# Altium schematic sheet Buck.SchDoc
size A4
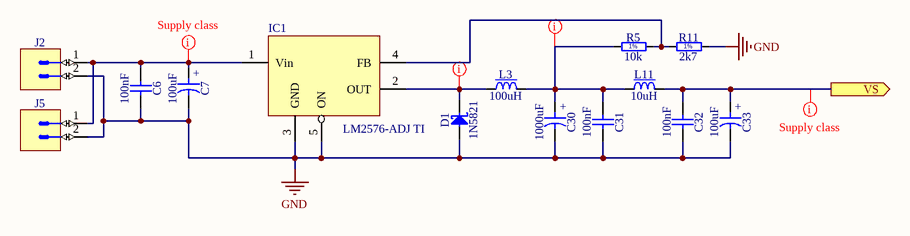
[diagram p0: Buck.SchDoc]

## Parts
C6  100nF  [CAPC2012X135N]
C7  100uF  [CAPAE660X540N]
C30  1000uF  [CAPPR750-1650X1600]
C31  100nF  [CAPC2012X135N]
C32  100nF  [CAPC2012X135N]
C33  100uF  [CAPAE660X540N]
D1  1N5821  [DO-201AD]
IC1  LM2576-ADJ TI  [DPAK170P1435X465-6N]
J2  (no value)  [CAMDEN_CTB9350/2A]
J5  KK®  [MOLEX_22-04-1021]  (value not drawn)
L3  100uH  [IND_WURTH_WE-PD_XXL]
L11  10uH  [INDM6965X300N]
R5  10k  [RESC2012X60N]
R11  2k7  [RESC2012X60N]

## Ports
VS (out)

## Nets
GND: C6.2 C7.2 C30.2 C31.2 C32.2 C33.2 D1.2(A) IC1.3(GND) IC1.5(ON) J2.2 J5.2 R11.2
VS: C32.1 C33.1 L11.2 ; port VS
NetC6_1: C6.1 C7.1 IC1.1(Vin) J2.1 J5.1
NetC30_1: C30.1 C31.1 L3.2 L11.1 R5.1
NetD1_1: D1.1(C) IC1.2(OUT) L3.1
NetIC1_4: IC1.4(FB) R5.2 R11.1

Not connected (* = marked no-connect by the designer): IC1 6(GND)

## Layout directives
net class Supply: NetC6_1, NetC30_1, NetD1_1, VS

## Notes on the sheet
- (in symbol CAE660-540_100UF_16V_20%) +
- (in symbol CAER_1000UF_25V_20%_PANASONIC_EEUFC1E102S) +
- (in symbol R0805_2K7_1%_0.125W_100PPM) 1%
- (in symbol R0805_10K_1%_0.125W_100PPM) 1%

## Library data of the parts
C6 C31 C32 = CC0805_100NF_50V_10%_X7R: Non-polarised capacitor; Part Description: SMD Multilayer Chip Ceramic Capacitor; Manufacturer: GENERIC; Manufacturer1 Part Number: C2012X7R1H104K085AA; Voltage: 50V; TC: X7R; Tolerance: ±10%; Part Number: CC0805_100NF_50V_10%_X7R; Component Kind: Standard; Component Type: Standard; Pin Count: 2; Value: 100nF; Status: Preferred; Manufacturer Part Number: CC0805_100NF_50V_10%_X7R; Case: 0805; Mounted: Yes; Socket: No; SMD: Yes; Sense: No; Manufacturer1 Example: TDK; Manufacturer1 ComponentHeight: 1mm; HelpURL: \\cern.ch\dfs\Applications\Altium\Datasheets\CC0805_X7R_TDK_C.pdf; Author: CERN DEM JLC; CreateDate: 03.12.2007; LatestRevisionDate: 22.04.2015
C7 C33 = CAE660-540_100UF_16V_20%: Polarised capacitor; Part Description: Aluminum Electrolytic SMT Capacitor; Manufacturer: PANASONIC; Manufacturer Part Number: EEEFK1C101AP; Voltage: 16V; Tolerance: ±20%; Part Number: CAE660-540_100UF_16V_20%; Component Kind: Standard; Component Type: Standard; Pin Count: 2; Value: 100uF; Status: Not Recommended; Case: D; Mounted: Yes; Socket: No; SMD: Yes; Sense: No; ComponentHeight: 5.8mm; HelpURL: \\cern.ch\dfs\Applications\Altium\Datasheets\CAE_PANASONIC_FK.pdf; Author: CERN DEM JLC; CreateDate: 03.12.2007; LatestRevisionDate: 05.11.2014
C30 = CAER_1000UF_25V_20%_PANASONIC_EEUFC1E102S: Polarised capacitor; Part Description: Z= 0R043, Radial Lead, Aluminum Electrolytic Capacitor, (FC Series, Type A); Voltage: 25V; Tolerance: ±20%; Part Number: CAER_1000UF_25V_20%_PANASONIC_EEUFC1E102S; Component Kind: Standard; Component Type: Standard; Pin Count: 2; Value: 1000uF; Status: None; Manufacturer: PANASONIC; Manufacturer Part Number: EEUFC1E102S; Case: LS7.5 D16.5 x H16; Mounted: Yes; Socket: No; SMD: No; Sense: No; ComponentHeight: 16mm; HelpURL: \\cern.ch\dfs\Applications\Altium\Datasheets\CAER_PANASONIC_FC-A.pdf; Author: CERN DEM JMW; CreateDate: 02.07.2015; LatestRevisionDate: 02.07.2015
D1 = 1N5821: Schottky Diode; Part Description: Schottky Rectifier; Manufacturer: FAIRCHILD SEMICONDUCTOR; Voltage: 30V; Power: 3A; PressFit: No; Bonding: No; Part Number: 1N5821; Component Kind: Standard; Component Type: Standard; Device: 1N5821; PackageDescription: DO-201AD, Diode, Axial; Lead Spacing 20.32mm, Lead Dia. 1.3mm, Body Length 9.5mm, Body Dia. 5.6mm; Manufacturer Part Number: 1N5821; Pin Count: 2; Case: DO-201AD; Mounted: Yes; Socket: No; SMD: No; Sense: No; ComponentHeight: 5.6mm; HelpURL: \\cern.ch\dfs\Applications\Altium\Datasheets\1N5821.pdf; Author: CERN DEM JLC; CreateDate: 05.03.2012; LatestRevisionDate: 05.03.2012
IC1 = LM2576-ADJ: Name: LM2576-ADJ; Manufacturer: TI
J2 = CAMDEN_CTB9350/2A: Connector 2 Male; Part Description: 12A 380V, Pitch: 5mm, 2 Positions, Horizontal  Male Terminal Block; Manufacturer: CAMDEN; PressFit: No; Part Number: CAMDEN_CTB9350/2A; Component Kind: Standard; Component Type: Standard; Pin Count: 2; Mounted: Yes; Socket: No; SMD: No; Sense: No; Status: None; Manufacturer Part Number: CTB9350/2A; ComponentHeight: 8.3mm; HelpURL: \\cern.ch\dfs\Applications\Altium\Datasheets\CAMDEN_CTB9350-2A.pdf; Author: CERN DEM JLC; CreateDate: 28.09.2011; LatestRevisionDate: 28.09.2011
J5 = MOLEX_22-04-1021: Connector 2 Male; Part Description: 2.5mm (.100") Pitch KK® Wire-to-Board Header, Vertical, with Friction Lock, 2 Circuits, Tin (Sn) Plating; Manufacturer: MOLEX; PressFit: No; Part Number: MOLEX_22-04-1021; Component Kind: Standard; Component Type: Standard; Pin Count: 2; Family: KK®; Mounted: Yes; Socket: No; SMD: No; Sense: No; Status: None; Manufacturer Part Number: 22-04-1021; ComponentHeight: 11.7mm; HelpURL: \\cern.ch\dfs\Applications\Altium\Datasheets\MOLEX_22-04-1021.pdf; Author: CERN DEM JLC; CreateDate: 09.02.2012; LatestRevisionDate: 09.02.2012
L3 = IND_100UH_20%_WURTH_WE-PD_7447709101: Inductor With Core; Part Description: Power-Choke Inductor (WE-PD Series); Manufacturer: WURTH ELEKTRONIK; Power: 2.5A; Resistance: 0.1R; Tolerance: ±20%; Part Number: IND_100UH_20%_WURTH_WE-PD_7447709101; Component Kind: Standard; Component Type: Standard; Pin Count: 2; Value: 100uH; Status: None; Manufacturer Part Number: 7447709101; Mounted: Yes; Socket: No; SMD: Yes; Sense: No; ComponentHeight: 10mm; HelpURL: \\cern.ch\dfs\Applications\Altium\Datasheets\IND_WURTH_WE-PD_7447709101.pdf; Author: CERN DEM JLC; CreateDate: 15.03.2012; LatestRevisionDate: 15.03.2012
L11 = IND2525_10UH_20%_VISHAY_IHLP-2525CZ: Inductor With Core; Part Description: Low Profile, High Current IHLP® Inductor; Manufacturer: VISHAY DALE; Manufacturer Part Number: IHLP2525CZER100M01; Power: 3A; Resistance: 0.102R; Tolerance: ±20%; Part Number: IND2525_10UH_20%_VISHAY_IHLP-2525CZ; Component Kind: Standard; Component Type: Standard; Pin Count: 2; Value: 10uH; Status: None; Case: 2525; Mounted: Yes; Socket: No; SMD: Yes; Sense: No; ComponentHeight: 3mm; HelpURL: \\cern.ch\dfs\Applications\Altium\Datasheets\IND2525_VISHAY_IHLP-2525CZ.pdf; Author: CERN DEM JLC; CreateDate: 19.01.2015; LatestRevisionDate: 19.01.2015
R5 = R0805_10K_1%_0.125W_100PPM: Resistor - 1%; Part Description: General Purpose Thick Film Chip Resistor; Manufacturer: GENERIC; Manufacturer1 Part Number: NRC10F1002TRF; Power: 0.125W; TC: ±100ppm/°C; PressFit: No; Part Number: R0805_10K_1%_0.125W_100PPM; Component Kind: Standard; Component Type: Standard; Pin Count: 2; Value: 10k; Status: Preferred; Tolerance: ±1%; Manufacturer Part Number: R0805_10K_1%_0.125W_100PPM; Case: 0805; Mounted: Yes; Sense: No; Socket: No; SMD: Yes; Manufacturer1 Example: NIC COMPONENT; Manufacturer1 ComponentHeight: 0.6mm; HelpURL: \\cern.ch\dfs\Applications\Altium\Datasheets\R0805_NIC_NRC.pdf; Author: CERN DEM JLC; CreateDate: 03.12.2007; LatestRevisionDate: 13.03.2008
R11 = R0805_2K7_1%_0.125W_100PPM: Resistor - 1%; Part Description: General Purpose Thick Film Chip Resistor; Manufacturer: GENERIC; Manufacturer1 Part Number: NRC10F2701TRF; Power: 0.125W; TC: ±100ppm/°C; PressFit: No; Part Number: R0805_2K7_1%_0.125W_100PPM; Component Kind: Standard; Component Type: Standard; Pin Count: 2; Value: 2k7; Status: Preferred; Tolerance: ±1%; Manufacturer Part Number: R0805_2K7_1%_0.125W_100PPM; Case: 0805; Mounted: Yes; Sense: No; Socket: No; SMD: Yes; Manufacturer1 Example: NIC COMPONENT; Manufacturer1 ComponentHeight: 0.6mm; HelpURL: \\cern.ch\dfs\Applications\Altium\Datasheets\R0805_NIC_NRC.pdf; Author: CERN DEM JLC; CreateDate: 08.06.2010; LatestRevisionDate: 08.06.2010